# Altium project BÖHM_Project.PrjPcb
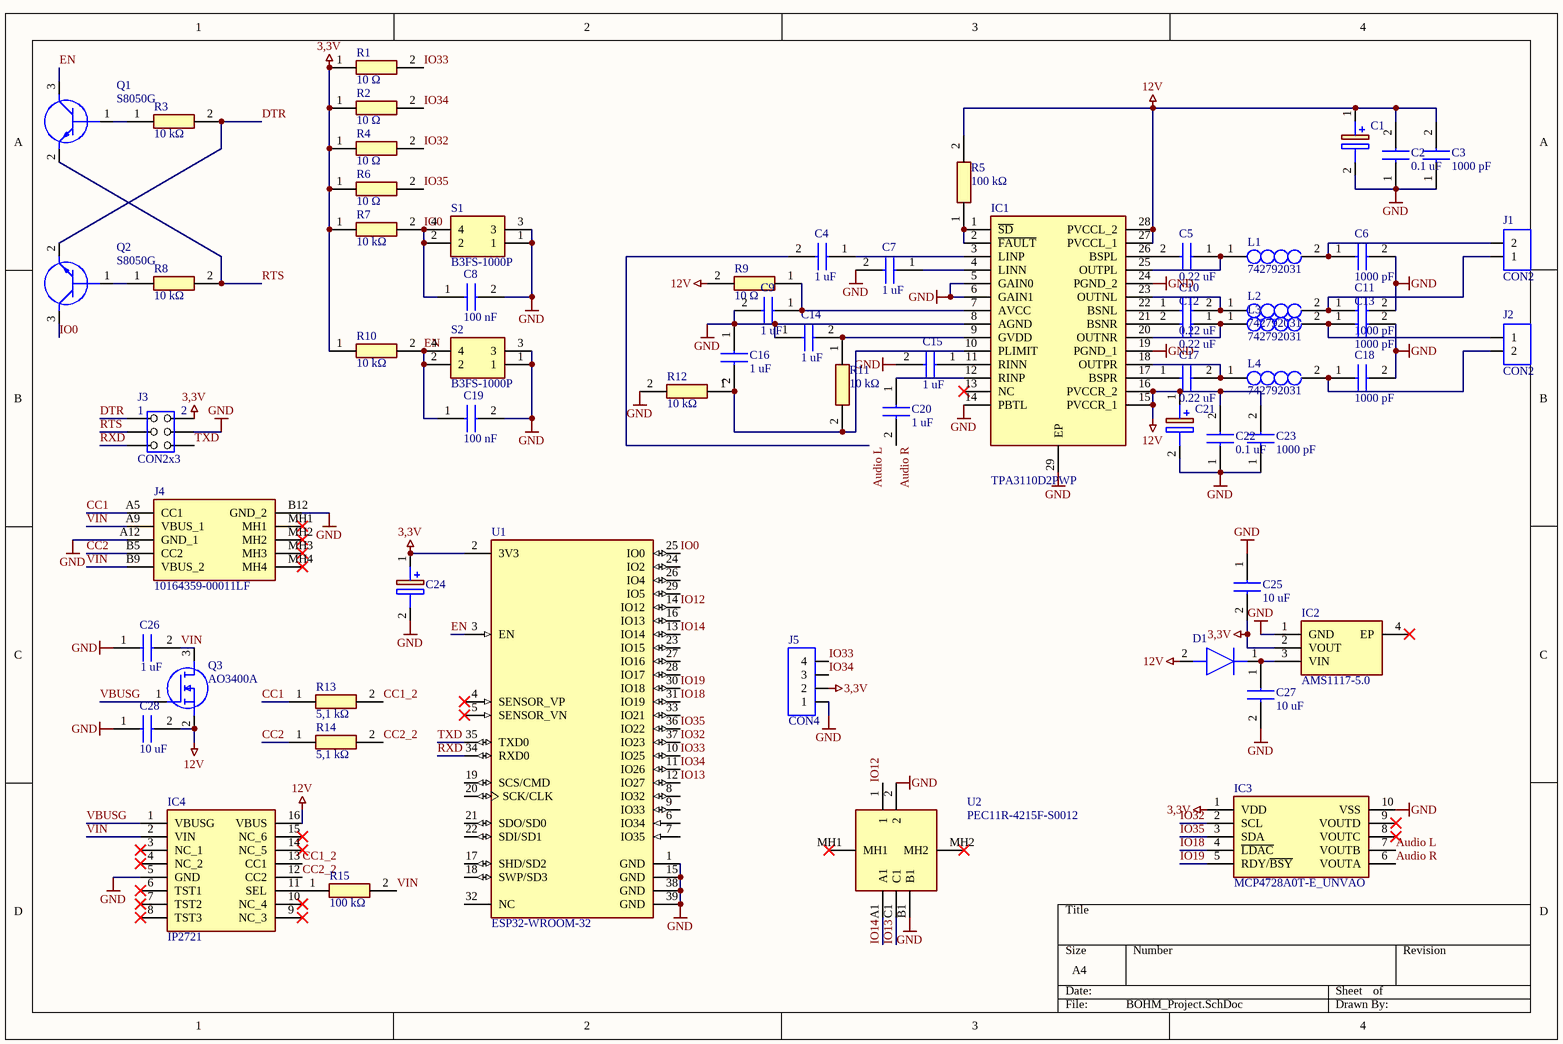
[diagram p0: BÖHM_Project.SchDoc]
1 sheet, 64 parts. Net scope: global (net labels, ports and power ports of the same name join across sheets).
Board file: BÖHM_Project.PcbDoc

## Sheet BÖHM_Project.SchDoc
size A4; SheetNumber: 1; SheetTotal: 1

### Parts
C1  EEE-FN1V101XP  [EEE0JA331XP]  (value not drawn)
C2  0.1 uF  [CAPC2012X94N]
C3  1000 pF  [CAPC2012X94N]
C4  1 uF  [CAPC2012X94N]
C5  0.22 uF  [CAPC2012X94N]
C6  1000 pF  [CAPC2012X94N]
C7  1 uF  [CAPC2012X94N]
C8  100 nF  [CAPC2012X94N]
C9  1 uF  [CAPC2012X94N]
C10  0.22 uF  [CAPC2012X94N]
C11  1000 pF  [CAPC2012X94N]
C12  0.22 uF  [CAPC2012X94N]
C13  1000 pF  [CAPC2012X94N]
C14  1 uF  [CAPC2012X94N]
C15  1 uF  [CAPC2012X94N]
C16  1 uF  [CAPC2012X94N]
C17  0.22 uF  [CAPC2012X94N]
C18  1000 pF  [CAPC2012X94N]
C19  100 nF  [CAPC2012X94N]
C20  1 uF  [CAPC2012X94N]
C21  EEE-FN1V101XP  [EEE0JA331XP]  (value not drawn)
C22  0.1 uF  [CAPC2012X94N]
C23  1000 pF  [CAPC2012X94N]
C24  EEE-FN1V101XP  [EEE0JA331XP]  (value not drawn)
C25  10 uF  [CAPC2012X94N]
C26  1 uF  [CAPC2012X94N]
C27  10 uF  [CAPC2012X94N]
C28  10 uF  [CAPC2012X94N]
D1  1N4148W_RHG  [1N4148WRHG]  (value not drawn)
IC1  TPA3110D2PWP  [SOP65P640X120-29N]
IC2  AMS1117-5.0  [SOT290P700X180-4N]
IC3  MCP4728A0T-E_UNVAO  [SOP50P490X110-10N]
IC4  IP2721  [SOP65P640X120-16N]
J1  CON2  [SIP-2]
J2  CON2  [SIP-2]
J3  CON2x3  [PFOSTEN_2x3]
J4  10164359-00011LF  [1016435900011LF]
J5  CON4  [Sip-4]
L1  742792031  [INDC2012X100N]
L2  742792031  [INDC2012X100N]
L3  742792031  [INDC2012X100N]
L4  742792031  [INDC2012X100N]
Q1  S8050G  [SOT95P240X110-3N]
Q2  S8050G  [SOT95P240X110-3N]
Q3  AO3400A  [SOT95P280X125-3N]
R1  10 Ω  [RESC2012X65N]
R2  10 Ω  [RESC2012X65N]
R3  10 kΩ  [RESC2012X65N]
R4  10 Ω  [RESC2012X65N]
R5  100 kΩ  [RESC2012X65N]
R6  10 Ω  [RESC2012X65N]
R7  10 kΩ  [RESC2012X65N]
R8  10 kΩ  [RESC2012X65N]
R9  10 Ω  [RESC2012X65N]
R10  10 kΩ  [RESC2012X65N]
R11  10 kΩ  [RESC2012X65N]
R12  10 kΩ  [RESC2012X65N]
R13  5,1 kΩ  [RESC2012X65N]
R14  5,1 kΩ  [RESC2012X65N]
R15  100 kΩ  [RESC2012X65N]
S1  B3FS-1000P  [B3FS-1000P]
S2  B3FS-1000P  [B3FS-1000P]
U1  ESP32-WROOM-32  [MODULE_ESP32-WROOM-32]
U2  PEC11R-4215F-S0012  [PEC11R4220FS0024]

### Nets
3,3V: C24.1(+) C25.2 IC2.2(VOUT) IC3.1(VDD) J3.2 J5.2 R1.1 R2.1 R4.1 R6.1 R7.1 R10.1 U1.2(3V3)
12V: C1.1(+) C2.2 C3.2 C21.1(+) C22.2 C23.2 C28.2 D1.2(A) IC1.15(PVCCR_1) IC1.16(PVCCR_2) IC1.27(PVCCL_1) IC1.28(PVCCL_2) IC4.16(VBUS) Q3.2(S) R5.2 R9.2
GND: C1.2(-) C2.1 C3.1 C6.2 C7.2 C8.2 C9.2 C11.2 C13.2 C14.1 C15.2 C16.1 C18.2 C19.2 C21.2(-) C22.1 C23.1 C24.2(-) C25.1 C26.1 C27.2 C28.1 IC1.5(GAIN0) IC1.6(GAIN1) IC1.8(AGND) IC1.14(PBTL) IC1.19(PGND_1) IC1.24(PGND_2) IC1.29(EP) IC2.1(GND) IC3.10(VSS) IC4.5(GND) J3.4 J4.A12(GND_1) J4.B12(GND_2) J5.1 R12.2 S1.1 S1.3 S2.1 S2.3 U1.1(GND) U1.15(GND) U1.38(GND) U1.39(GND) U2.2 U2.B1
Audio L: C4.2 IC3.7(VOUTB)
Audio R: C20.2 IC3.6(VOUTA)
CC1: J4.A5(CC1) R13.1
CC1_2: IC4.13(CC1) R13.2
CC2: J4.B5(CC2) R14.1
CC2_2: IC4.12(CC2) R14.2
DTR: J3.1 Q2.2(E) R3.2
EN: C19.1 Q1.3(C) R10.2 S2.2 S2.4 U1.3(EN)
IO0: C8.1 Q2.3(C) R7.2 S1.2 S1.4 U1.25(IO0)
IO12: U1.14(IO12) U2.1
IO13: U1.12(IO27) U2.C1
IO14: U1.13(IO14) U2.A1
IO18: IC3.4(~{LDAC}) U1.31(IO19)
IO19: IC3.5(RDY/~{BSY}) U1.30(IO18)
IO32: IC3.2(SCL) R4.2 U1.37(IO23)
IO33: J5.4 R1.2 U1.10(IO25)
IO34: J5.3 R2.2 U1.11(IO26)
IO35: IC3.3(SDA) R6.2 U1.36(IO22)
RTS: J3.3 Q1.2(E) R8.2
RXD: J3.5 U1.34(RXD0)
TXD: J3.6 U1.35(TXD0)
VBUSG: IC4.1(VBUSG) Q3.1(G)
VIN: C26.2 IC4.2(VIN) J4.A9(VBUS_1) J4.B9(VBUS_2) Q3.3(D) R15.2
NetC4_1: C4.1 IC1.3(LINP)
NetC5_1: C5.1 IC1.25(OUTPL) L1.1
NetC5_2: C5.2 IC1.26(BSPL)
NetC6_1: C6.1 J1.2 L1.2
NetC7_1: C7.1 IC1.4(LINN)
NetC9_1: C9.1 IC1.7(AVCC) R9.1
NetC10_1: C10.1 IC1.22(BSNL)
NetC10_2: C10.2 IC1.23(OUTNL) L2.1
NetC11_1: C11.1 J1.1 L2.2
NetC12_1: C12.1 IC1.20(OUTNR) L3.1
NetC12_2: C12.2 IC1.21(BSNR)
NetC13_1: C13.1 J2.1 L3.2
NetC14_2: C14.2 IC1.9(GVDD) R11.1
NetC15_1: C15.1 IC1.11(RINN)
NetC16_2: C16.2 IC1.10(PLIMIT) R11.2 R12.1
NetC17_1: C17.1 IC1.17(BSPR)
NetC17_2: C17.2 IC1.18(OUTPR) L4.1
NetC18_1: C18.1 J2.2 L4.2
NetC20_1: C20.1 IC1.12(RINP)
NetC27_1: C27.1 D1.1(K) IC2.3(VIN)
NetIC1_1: IC1.1(~{SD}) IC1.2(~{FAULT}) R5.1
NetIC4_11: IC4.11(SEL) R15.1
NetQ1_1: Q1.1(B) R3.1
NetQ2_1: Q2.1(B) R8.1

Not connected (* = marked no-connect by the designer): IC1 13(NC)*; IC2 4(EP)*; IC3 8(VOUTC)* 9(VOUTD)*; IC4 3(NC_1)* 4(NC_2)* 6(TST1)* 7(TST2)* 8(TST3)* 9(NC_3)* 10(NC_4)* 14(NC_5)* 15(NC_6)*; J4 MH1* MH2* MH3* MH4*; U1 4(SENSOR_VP)* 5(SENSOR_VN)* 6(IO34) 7(IO35) 8(IO32) 9(IO33) 16(IO13) 17(SHD/SD2) 18(SWP/SD3) 19(SCS/CMD) 20(SCK/CLK) 21(SDO/SD0) 22(SDI/SD1) 23(IO15) 24(IO2) 26(IO4) 27(IO16) 28(IO17) 29(IO5) 32(NC) 33(IO21); U2 MH1* MH2*

### Library data of the parts
C1 C21 C24 = EEE-FN1V101XP: Capacitor Polarised; Manufacturer_Name: Panasonic; Datasheet Link: http://industrial.panasonic.com/cdbs/www-data/pdf/RDE0000/RDE0000C1259.pdf; Height: 7.8mm; Manufacturer_Part_Number: EEE-FN1V101XP; Mouser Part Number: 667-EEE-FN1V101XP; Mouser Price/Stock: https://www.mouser.co.uk/ProductDetail/Panasonic/EEE-FN1V101XP?qs=OlC7AqGiEDmbk%2FCOXeagbw%3D%3D; Arrow Part Number: EEE-FN1V101XP; Arrow Price/Stock: https://www.arrow.com/en/products/eee-fn1v101xp/panasonic
C2-C20 C22 C23 C25-C28 = 04026W105KAT2A: Capacitor; Manufacturer_Name: Kyocera AVX; Datasheet Link: http://www.mouser.com/catalog/supplier/library/pdf/AVXSurfaceMountCeramic.pdf; Height: 0.56mm; Manufacturer_Part_Number: 04026W105KAT2A; Mouser Part Number: 581-04026W105KAT2A; Mouser Price/Stock: https://www.mouser.co.uk/ProductDetail/KYOCERA-AVX/04026W105KAT2A?qs=QKPlp7%252B%252BMySX2WX75ls0%252Bw%3D%3D
D1 = 1N4148W_RHG: Diode; Manufacturer_Name: Taiwan Semiconductor; Manufacturer_Part_Number: 1N4148W RHG; Datasheet Link: https://mouser.componentsearchengine.com/Datasheets/1/1N4148W RHG.pdf; Height: 1.15mm; Mouser Part Number: 821-1N4148WRHG; Mouser Price/Stock: https://www.mouser.co.uk/ProductDetail/Taiwan-Semiconductor/1N4148W-RHG?qs=KwaGCOX4wIag2YPLXylAvA%3D%3D; Arrow Part Number: 1N4148W RHG; Arrow Price/Stock: https://www.arrow.com/en/products/1n4148wrhg/taiwan-semiconductor?region=europe
IC1 = TPA3110D2PWP: Integrated Circuit; Manufacturer_Name: Texas Instruments; Datasheet Link: http://componentsearchengine.com/Datasheets/3/TPA3110D2PWP.pdf; Height: 1.2mm; Manufacturer_Part_Number: TPA3110D2PWP; Mouser Part Number: 595-TPA3110D2PWP; Mouser Price/Stock: https://www.mouser.co.uk/ProductDetail/Texas-Instruments/TPA3110D2PWP?qs=%252BoZa6nMD7VtKcnryxAFqkA%3D%3D; Arrow Part Number: TPA3110D2PWP; Arrow Price/Stock: https://www.arrow.com/en/products/tpa3110d2pwp/texas-instruments?region=nac
IC2 = AMS1117-5.0: Integrated Circuit; Manufacturer_Name: Shikues; Datasheet Link: https://datasheet.lcsc.com/szlcsc/SK-AMS1117-5-0_C165483.pdf; Height: 1.8mm; Manufacturer_Part_Number: AMS1117-5.0
IC3 = MCP4728A0T-E_UNVAO: Integrated Circuit; Manufacturer_Name: Microchip; Manufacturer_Part_Number: MCP4728A0T-E/UNVAO; Datasheet Link: https://www.arrow.com/en/products/mcp4728a0t-eunvao/microchip-technology; Height: 1.1mm; Mouser Part Number: 579-MCP4728A0TEUNVAO; Mouser Price/Stock: https://www.mouser.co.uk/ProductDetail/Microchip-Technology/MCP4728A0T-E-UNVAO?qs=5aG0NVq1C4xwp5%2FuVndkIg%3D%3D; Arrow Part Number: MCP4728A0T-E/UNVAO; Arrow Price/Stock: https://www.arrow.com/en/products/mcp4728a0t-eunvao/microchip-technology
IC4 = IP2721: Integrated Circuit; Manufacturer_Name: INJOINIC; Datasheet Link: https://datasheet.lcsc.com/szlcsc/2006111335_INJOINIC-IP2721_C603176.pdf; Height: 1.2mm; Manufacturer_Part_Number: IP2721
J1 J2 = CON2: Stecker
J3 = CON2x3: Stecker
J4 = 10164359-00011LF: Connector; Manufacturer_Name: Amphenol; Datasheet Link: https://cdn.amphenol-cs.com/media/wysiwyg/files/drawing/10164359.pdf; Height: 3.41mm; Manufacturer_Part_Number: 10164359-00011LF; Mouser Part Number: 649-10164359-00011LF; Mouser Price/Stock: https://www.mouser.co.uk/ProductDetail/Amphenol-FCI/10164359-00011LF?qs=MyNHzdoqoQLpQ%2FmSqA1%252BtQ%3D%3D; Arrow Part Number: 10164359-00011LF; Arrow Price/Stock: https://www.arrow.com/en/products/10164359-00011lf/amphenol-fci?region=nac
J5 = CON4: Stecker
L1-L4 = 742792031: Inductor; Manufacturer_Name: Wurth Elektronik; Datasheet Link: https://componentsearchengine.com/Datasheets/2/742792031.pdf; Height: 1mm; Manufacturer_Part_Number: 742792031; Mouser Part Number: 710-742792031; Mouser Price/Stock: https://www.mouser.co.uk/ProductDetail/Wurth-Elektronik/742792031?qs=Wn16VcyqZWp8eQwMnPa%252Bwg%3D%3D
Q1 Q2 = S8050G: Transistor BJT NPN; Manufacturer_Name: Galaxy; Height: 1.1mm; Manufacturer_Part_Number: S8050G
Q3 = AO3400A: MOSFET (N-Channel); Manufacturer_Name: Alpha & Omega Semiconductors; Datasheet Link: http://aosmd.com/res/data_sheets/AO3400A.pdf; Height: 1.25mm; Manufacturer_Part_Number: AO3400A; Arrow Part Number: AO3400A; Arrow Price/Stock: https://www.arrow.com/en/products/ao3400a/alpha-and-omega-semiconductor?utm_currency=USD&region=nac
R1-R15 = CPF0805B102RE1: Resistor; Manufacturer_Name: TE Connectivity; Datasheet Link: http://docs-europe.electrocomponents.com/webdocs/13d1/0900766b813d116f.pdf; Height: 0.65mm; Manufacturer_Part_Number: CPF0805B102RE1
S1 S2 = B3FS-1000P: Switch; Manufacturer_Name: Omron Electronics; Datasheet Link: https://www.omron.co.jp/ecb/products/pdf/b3fs.pdf; Manufacturer_Part_Number: B3FS-1000P; Mouser Part Number: 653-B3FS-1000P; Mouser Price/Stock: https://www.mouser.co.uk/ProductDetail/Omron-Electronics/B3FS-1000P?qs=ImaqFqjHA4k6odVF2%2FXWpQ%3D%3D; Arrow Part Number: B3FS-1000P; Arrow Price/Stock: https://www.arrow.com/en/products/b3fs-1000p/omron?region=nac
U1 = ESP32-WROOM-32: Bluetooth, WiFi 802.11b/g/n, Bluetooth v4.2 +EDR, Class 1, 2 and 3 Transceiver Module 2.4GHz ~ 2.5GHz Antenna Not Included, U.FL Surface Mount; MF: Espressif Systems; Price: None; Availability: In Stock; MP: ESP32-WROOM-32; Package: Module Espressif Systems; SnapEDA_Link: https://www.snapeda.com/parts/ESP32-WROOM-32/Espressif+Systems/view-part/?ref=snap; Check_prices: https://www.snapeda.com/parts/ESP32-WROOM-32/Espressif+Systems/view-part/?ref=eda; Value: *; Purchase-URL: https://pricing.snapeda.com/search/part/ESP32-WROOM-32/?ref=eda
U2 = PEC11R-4215F-S0012: Undefined or Miscellaneous; Manufacturer_Name: Bourns; Datasheet Link: https://www.bourns.com/docs/Product-Datasheets/PEC11R.pdf; Height: 27.5mm; Manufacturer_Part_Number: PEC11R-4215F-S0012; Mouser Part Number: 652-PEC11R-4215F-S12; Mouser Price/Stock: https://www.mouser.co.uk/ProductDetail/Bourns/PEC11R-4215F-S0012?qs=Zq5ylnUbLm4GqzIkqVmW4Q%3D%3D; Arrow Part Number: PEC11R-4215F-S0012; Arrow Price/Stock: https://www.arrow.com/en/products/pec11r-4215f-s0012/bourns?utm_currency=USD&region=nac